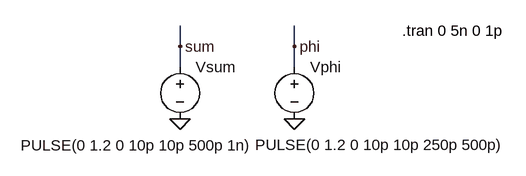
[diagram p0: schematic testInverter.asc]
testInverter.asc, the LTspice schematic file:
Version 4
SHEET 1 880 680
WIRE -96 96 -96 64
WIRE 80 96 80 64
WIRE -96 128 -96 96
WIRE 80 128 80 96
FLAG 80 208 0
FLAG 80 96 phi
FLAG -96 208 0
FLAG -96 96 sum
SYMBOL voltage 80 112 R0
WINDOW 3 -60 136 Left 2
WINDOW 123 0 0 Left 2
WINDOW 39 0 0 Left 2
SYMATTR InstName Vphi
SYMATTR Value PULSE(0 1.2 0 10p 10p 250p 500p)
SYMBOL voltage -96 112 R0
WINDOW 3 -245 137 Left 2
WINDOW 123 0 0 Left 2
WINDOW 39 0 0 Left 2
SYMATTR InstName Vsum
SYMATTR Value PULSE(0 1.2 0 10p 10p 500p 1n)
TEXT 246 72 Left 2 !.tran 0 5n 0 1p

The netlist it stands for:
* testInverter.asc
Vphi phi 0 PULSE(0 1.2 0 10p 10p 250p 500p)
Vsum sum 0 PULSE(0 1.2 0 10p 10p 500p 1n)
.tran 0 5n 0 1p
.backanno
.end

* Results of the author's LTspice run, read from the files saved beside the schematic
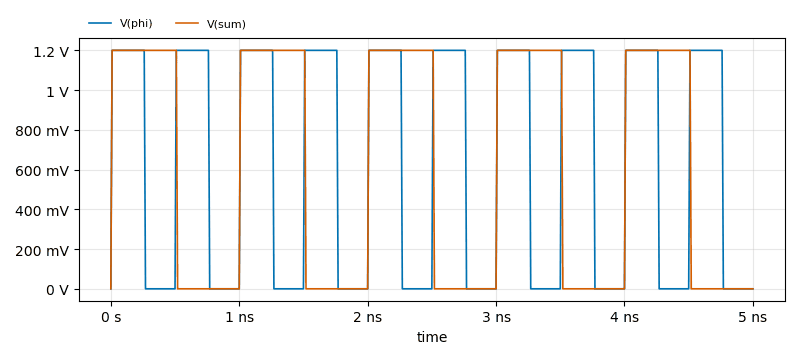
[diagram p1: Transient Analysis of testInverter.asc, plotted from the saved traces]
* Transient Analysis, 1 run:
*   V(phi): min 0 V, max 1.2 V, average 624 mV, rms 865.3 mV, last 0 V
*   V(sum): min 0 V, max 1.2 V, average 612 mV, rms 857 mV, last 0 V